# EasyEDA schematic schematic-EasyEDA.json
TITLE: Sheet_1; REV: 1.0; Date: 2022-01-08; Sheet: 1/1; Company: Your Company
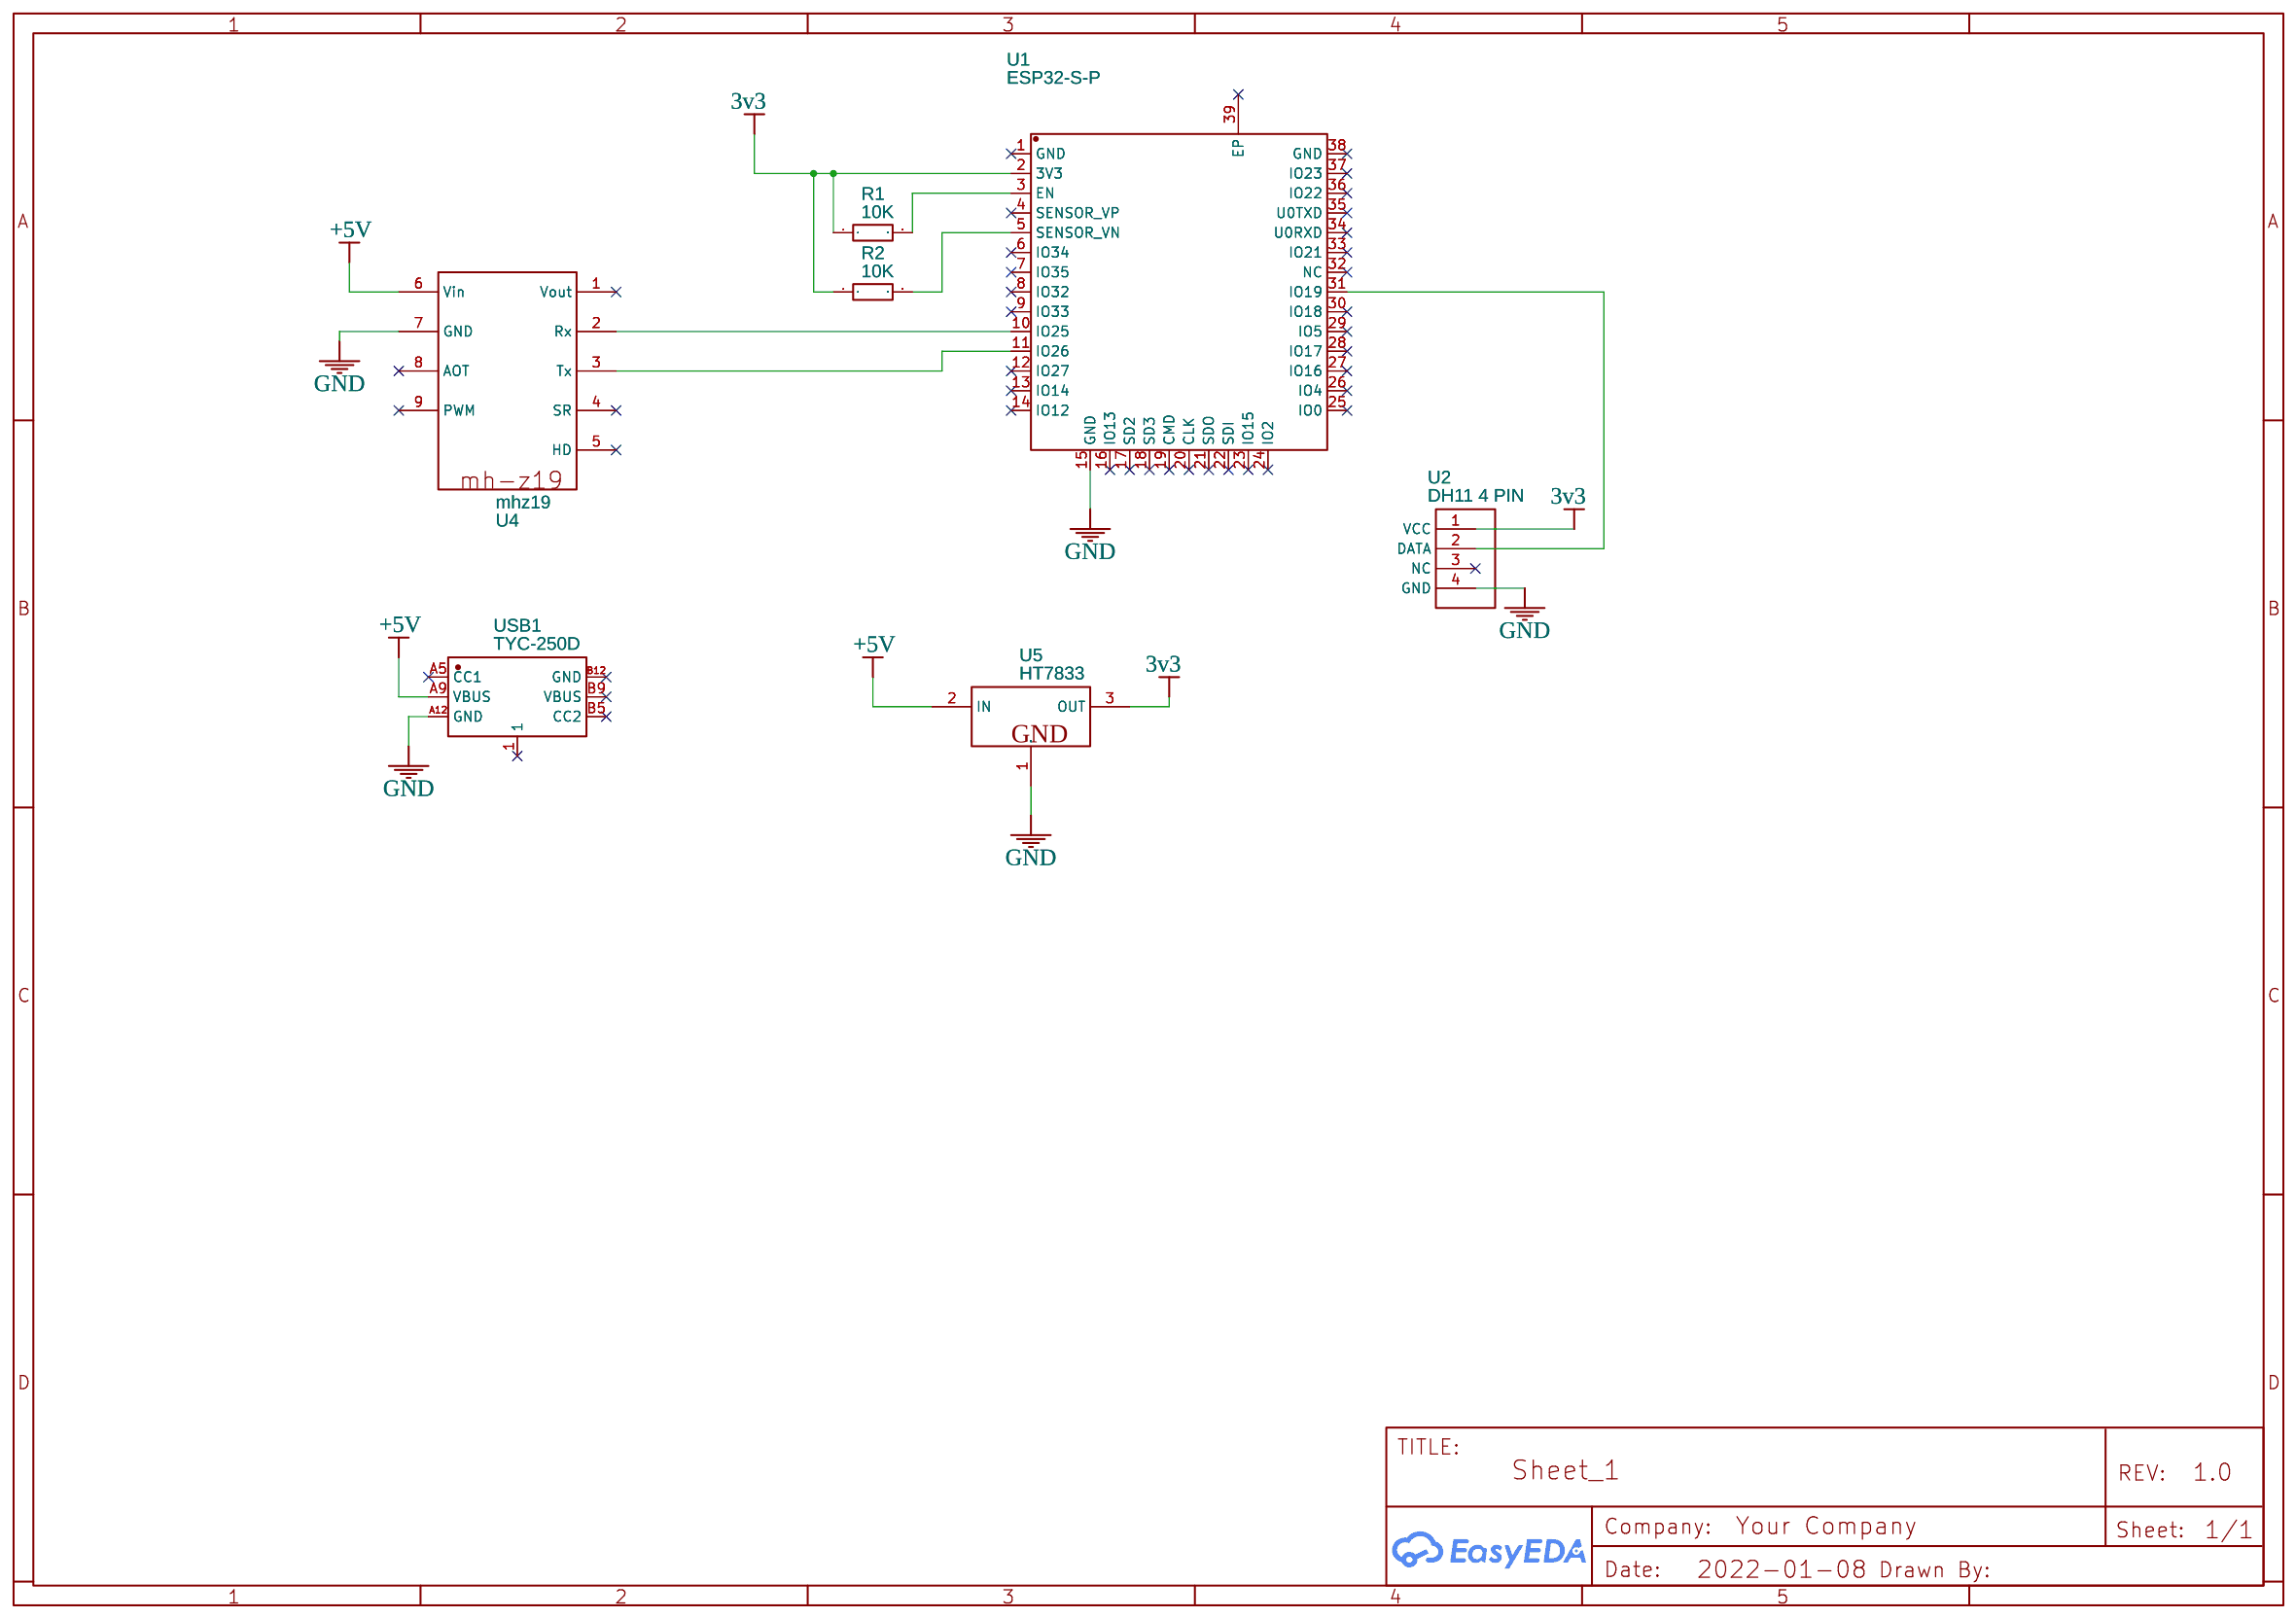
[diagram p0: schematic sheet]

## Parts
R1  10K  [RES-TH_BD4.0-L11.5-P15.50-D0.7]
R2  10K  [RES-TH_BD4.0-L11.5-P15.50-D0.7]
U1  ESP32-S-P  [WIRELM-SMD_ESP32-S]
U2  DH11 4 PIN  [DH11 4 PIN]
U4  mhz19  [MH-Z19]
U5  HT7833  [HT7333]
USB1  TYC-250D  [USB-C-SMD_TYC-250D]

## Library data of the parts
R1 R2 = 1623925-3: Supplier: LCSC; Supplier Part: C306261; Manufacturer: TE Connectivity; Contributor: LCSC; JLCPCB Part Class: Extended Part
U1 = ESP32-S-P: Supplier: LCSC; Supplier Part: C2764350; Manufacturer: null; JLCPCB Part Class: Extended Part; Contributor: LCSC
U2 = DH11 4 PIN: Contributor: plawren1
U4 = mhz19: Contributor: mikhser10
U5 = HT7333: Low Power Consumption LDO, Output Voltage 3.3V, SOT89 Pkg; sourceId: iuaKDxrJp
USB1 = TYC-250D: Supplier: LCSC; Supplier Part: C381470; Manufacturer: XUNPU; Contributor: LCSC; JLCPCB Part Class: Extended Part

## Nets
3v3: R1.1 R2.1 U1.2(3V3) U2.1(VCC) U5.3(OUT)
+5V: U4.6(Vin) U5.2(IN) USB1.A9(VBUS)
GND: U1.15(GND) U2.4(GND) U4.7(GND) U5.1(GND) USB1.A12(GND)
Net-(R1-2): R1.2 U1.3(EN)
Net-(R2-2): R2.2 U1.5(SENSOR_VN)
Net-(U1-10): U1.10(IO25) U4.2(Rx)
Net-(U1-11): U1.11(IO26) U4.3(Tx)
Net-(U1-31): U1.31(IO19) U2.2(DATA)

Not connected (* = marked no-connect by the designer): U1 1(GND)* 4(SENSOR_VP)* 6(IO34)* 7(IO35)* 8(IO32)* 9(IO33)* 12(IO27)* 13(IO14)* 14(IO12)* 16(IO13)* 17(SD2)* 18(SD3)* 19(CMD)* 20(CLK)* 21(SDO)* 22(SDI)* 23(IO15)* 24(IO2)* 25(IO0)* 26(IO4)* 27(IO16)* 28(IO17)* 29(IO5)* 30(IO18)* 32(NC)* 33(IO21)* 34(U0RXD)* 35(U0TXD)* 36(IO22)* 37(IO23)* 38(GND)* 39(EP)*; U2 3(NC)*; U4 1(Vout)* 4(SR)* 5(HD)* 8(AOT)* 9(PWM)*; USB1 1* A5(CC1)* B5(CC2)* B9(VBUS)* B12(GND)*
